# EAGLE design PDH_TransimpedanceAmp (EAGLE 6.5.0)
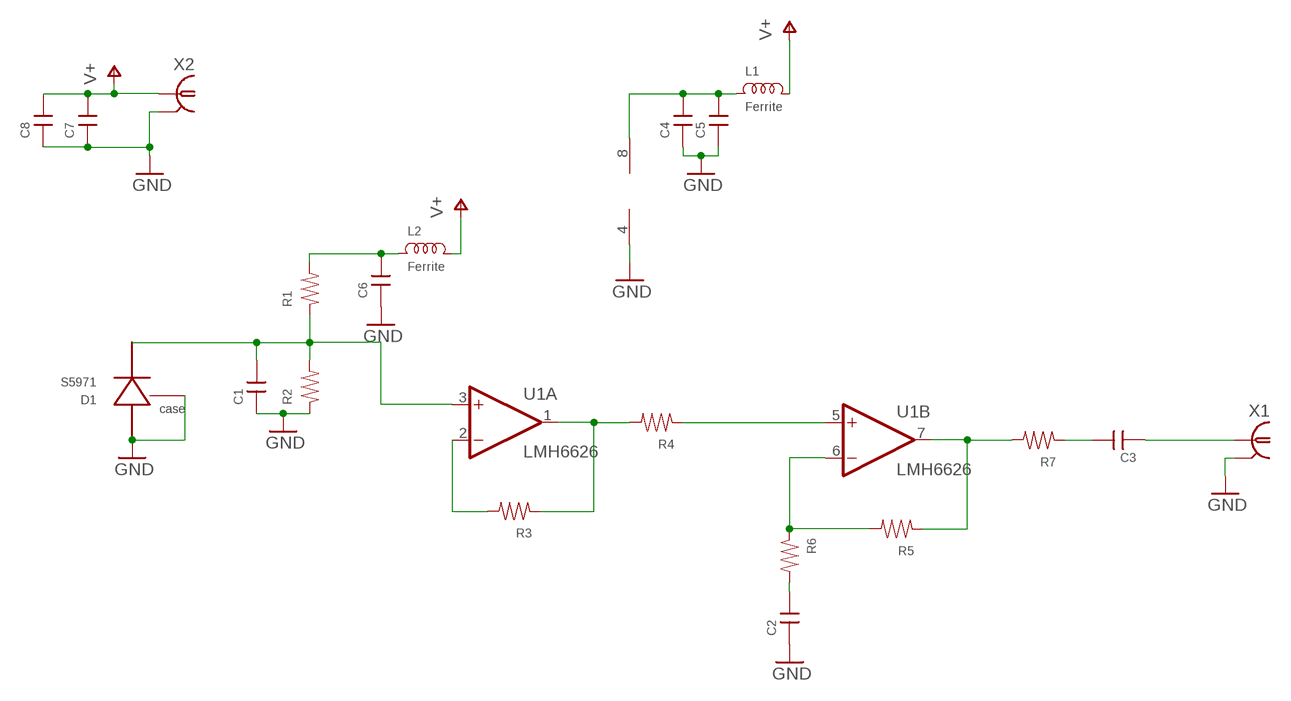
[diagram p0: schematic, sheet 1]

## Parts
C1  CAP0402  [0402]
C2  CAP0402  [0402]
C3  CAP0402  [0402]
C4  CAP0402  [0402]
C5  CAP0805  [0805]
C6  CAP0805  [0805]
C7  CAP0805  [0805]
C8  CAP0402  [0402]
D1  S5971  [S5971-CASE]
L1  Ferrite  INDUCTOR-0805  [0805]
L2  Ferrite  INDUCTOR-0805  [0805]
R1  RES0402  [0402]
R2  RES0402  [0402]
R3  RES0402  [0402]
R4  RES0402  [0402]
R5  RES0402  [0402]
R6  RES0402  [0402]
R7  RES0402  [0402]
U1  LMH6626  [SO08]
X1  UMC  [UMC]
X2  UMC  [UMC]

## Nets
GND: C1.1 C2.1 C4.1 C5.1 C6.1 C7.1 C8.1 D1.P$2(CASE) D1.P$3(ANODE) R2.1 U1.4(V-) X1.P$2 X1.P$3 X2.P$2 X2.P$3
N$1: C1.2 D1.P$1(CATHODE) R1.1 R2.2 U1.3(A:+IN)
N$2: R5.2 R6.1 U1.6(B:-IN)
N$3: C3.2 R7.1
N$4: R3.2 U1.2(A:-IN)
N$5: R3.1 R4.2 U1.1(A:OUT)
N$6: R4.1 U1.5(B:+IN)
N$7: C2.2 R6.2
N$8: R5.1 R7.2 U1.7(B:OUT)
N$9: C6.2 L2.1 R1.2
N$10: C4.2 C5.2 L1.1 U1.8(V+)
N$11: C3.1 X1.P$1
V+: C7.2 C8.2 L1.2 L2.2 X2.P$1

## Library data of the parts
C1-C8 = rlc-jqi:CAP: SMT Capacitor
D1 = RF_TransimpedanceAmp:S5971: Hamamatsu S5971 photodiode
L1 L2 = rlc-jqi:INDUCTOR: SMT Inductor.
R1-R7 = rlc-jqi:RES: SMT Resistor
U1 = RF_TransimpedanceAmp:LMH6626: TI dual op-amp LMH6626
X1 X2 = connector-jqi:UMC: UMC "ultra-miniature" Coaxial connector.

## Board
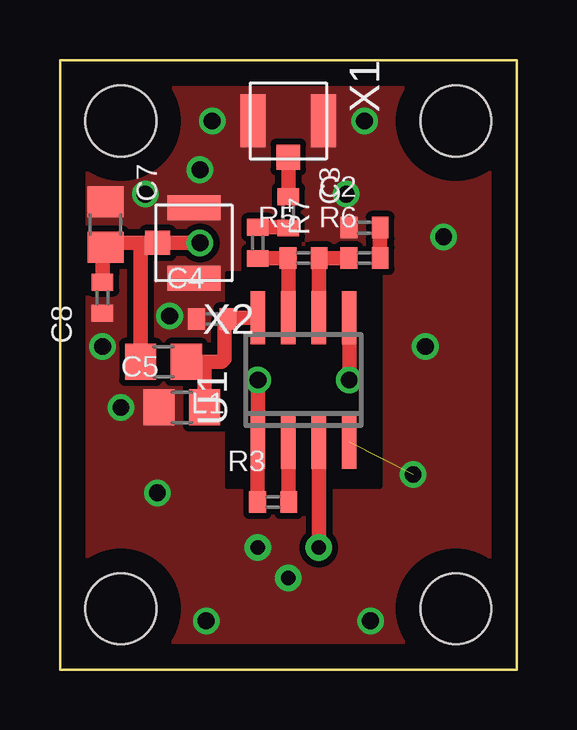
[diagram p1: board, top side]
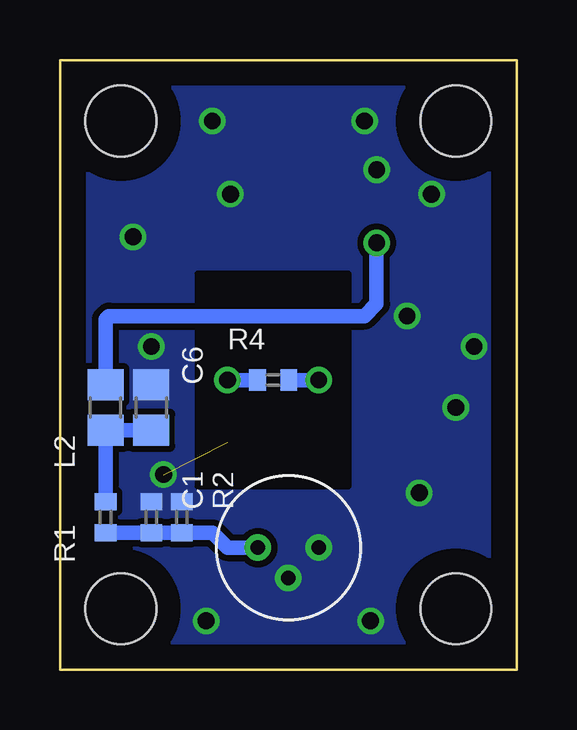
[diagram p2: board, bottom side, seen from below]

Size 19.05 x 25.4 mm. Coordinates in mm from the lower left corner, seen from the top.
Outline: 0,0 0,25.4 19.05,25.4 19.05,0 0,0
Copper layers (1*16): Top 0.035mm / dielectric 1.5mm / Bottom 0.035mm
Design rules "default": minimum track width 10mil, minimum drill 24mil, track to track 8mil, track to pad 8mil, pad to pad 8mil, via to via 8mil, smd to smd 8mil, copper to edge 40mil, drill to drill 8mil, minimum pad ring 10mil, minimum via ring 8mil, stop-mask expansion 4mil, vias tented up to drill 0mil, thermal gap 10mil
Holes 2.95 mm at 2.54,2.54 16.51,2.54 2.54,22.86 16.51,22.86

### Footprints (pad centres in the part's own frame; a part is rotated, then mirrored left to right if it is on the bottom)
0402 = smd 0.7 x 0.9: 1 -0.65,0; 2 0.65,0
0805 = smd 1.3 x 1.5: 1 -0.95,0; 2 0.95,0
S5971-CASE = drill 0.6: P$1 1.27,0; P$2 0,1.27; P$3 -1.27,0
SO08 = smd 2.2 x 0.6: 1 -2.6,1.27; 2 -2.6,0; 3 -2.6,-1.27; 4 -2.6,-2.54; 5 2.6,-2.54; 6 2.6,-1.27; 7 2.6,0; 8 2.6,1.27
UMC = smd 1.041 x 0.991: P$1 1.511,0 | smd 2.21 x 1.041: P$2 0,1.473; P$3 0,-1.473

### Placement (x,y rotation side)
C1  15.24,6.35 270 bottom
C2  12.7,18.41 0 top
C3  9.53,19.05 270 top
C4  6.35,14.61 0 top
C5  5.08,10.92 0 top
C6  15.24,10.92 270 bottom
C7  1.91,18.54 270 top
C8  1.78,15.49 90 top
D1  9.53,5.08 180 bottom
L1  4.32,12.83 180 top
L2  17.14,10.92 90 bottom
R1  17.14,6.35 90 bottom
R2  13.97,6.35 270 bottom
R3  8.89,6.99 0 top
R4  10.16,12.06 0 bottom
R5  10.16,17.14 0 top
R6  12.7,17.14 0 top
R7  8.26,17.78 270 top
U1  9.53,12.06 90 top
X1  9.53,22.86 270 top
X2  5.59,17.78 180 top

### Tracks (layer width: path | path; a pad name or v marks a point on that pad's centre or on a via)
GND  (via drill 0.7)  (1 unrouted)
  other vias: 1.78,13.46 2.54,10.92 4.06,7.37 15.24,13.46 14.73,8.13 12.95,2.03 16,18.03 11.94,19.81 12.7,22.86 6.35,22.86 5.84,20.83 4.57,14.73 3.56,19.81 6.1,2.03
  pour Top (isolate 0.254, no thermals): 0,25.4 19.05,25.4 19.05,0 0,0
  pour Bottom (isolate 0.254, no thermals): 0,25.4 19.05,25.4 19.05,0 0,0
N$1
  Top 0.61: U1.3 D1.P$1
  Bottom 0.61: R1.1 C1.2 R2.2 12.69,5.7 12.06,5.08 D1.P$1 10.79,5.07
N$2
  Top 0.61: U1.6 10.81,14.66 R5.2 R6.1
N$3
  Top 0.61: R7.1 9.49,18.43 C3.2
N$4
  Top 0.61: R3.2 9.53,6.99 U1.2
N$5  (via drill 0.7)
  Top 0.61: R3.1 8.24,9.46 U1.1 v8.26,12.06
  Bottom 0.61: v8.26,12.06 R4.2
N$6  (via drill 0.7)
  Top 0.61: v12.06,12.06 U1.5
  Bottom 0.61: R4.1 v12.06,12.06
N$7
  Top 0.61: C2.2 R6.2
N$8
  Top 0.61: U1.7 9.53,17.14 R5.1 8.27,17.14 R7.2
N$9
  Bottom 0.61: R1.2 L2.1 C6.2
N$10
  Top 0.61: U1.8 7,14.66 C4.2 6.86,14.46 6.86,12.95 6.73,12.83 6.1,12.83 | L1.1 6.1,12.83 | C5.2 6.03,12.76 6.1,12.83
N$11
  Top 0.61: C3.1 X1.P$1
N$12
  cutout Top (no thermals): 6.99,16.51 13.34,16.51 13.34,7.62 6.99,7.62
N$13
  cutout Bottom: 6.99,16.51 13.34,16.51 13.34,7.62 6.99,7.62
V+  (via drill 0.7)
  Top 0.61: 3.3,17.78 X2.P$1 v5.84,17.78 | 3.3,17.78 1.97,17.78 C7.2 1.78,17.72 C8.2 | L1.2 3.37,17.71 3.3,17.78
  Bottom 0.61: L2.2 17.14,14.61 17.02,14.73 6.35,14.73 5.84,15.24 v5.84,17.78